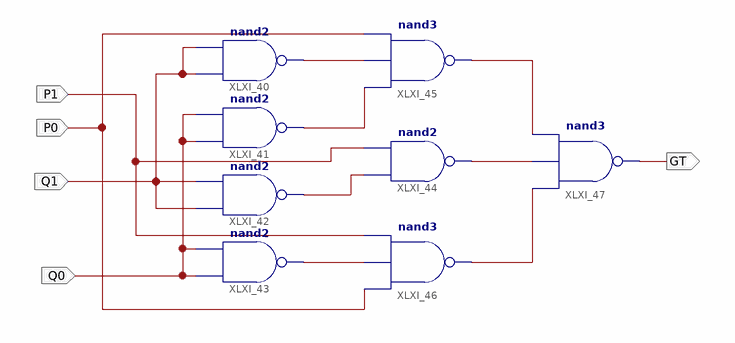
[diagram p0: schematic sheet 1]
// Xilinx ISE schematic circuit_nand.sch (spartan3e) as structural Verilog: 8 symbols, 5 ports
module circuit_nand (
  input  Q1,
  input  P1,
  input  Q0,
  input  P0,
  output GT
);

  wire XLXN_91, XLXN_92, XLXN_93, XLXN_94, XLXN_95, XLXN_96, XLXN_99;

  nand XLXI_44 (XLXN_95, XLXN_93, P1);
  nand XLXI_45 (XLXN_94, XLXN_92, XLXN_91, P0);
  nand XLXI_46 (XLXN_96, P0, XLXN_99, P1);
  nand XLXI_47 (GT, XLXN_96, XLXN_95, XLXN_94);
  nand XLXI_43 (XLXN_99, Q0, Q0);
  nand XLXI_42 (XLXN_93, Q1, Q1);
  nand XLXI_41 (XLXN_92, Q0, Q0);
  nand XLXI_40 (XLXN_91, Q1, Q1);
endmodule
